# Altium project uPICoid.PrjPCB
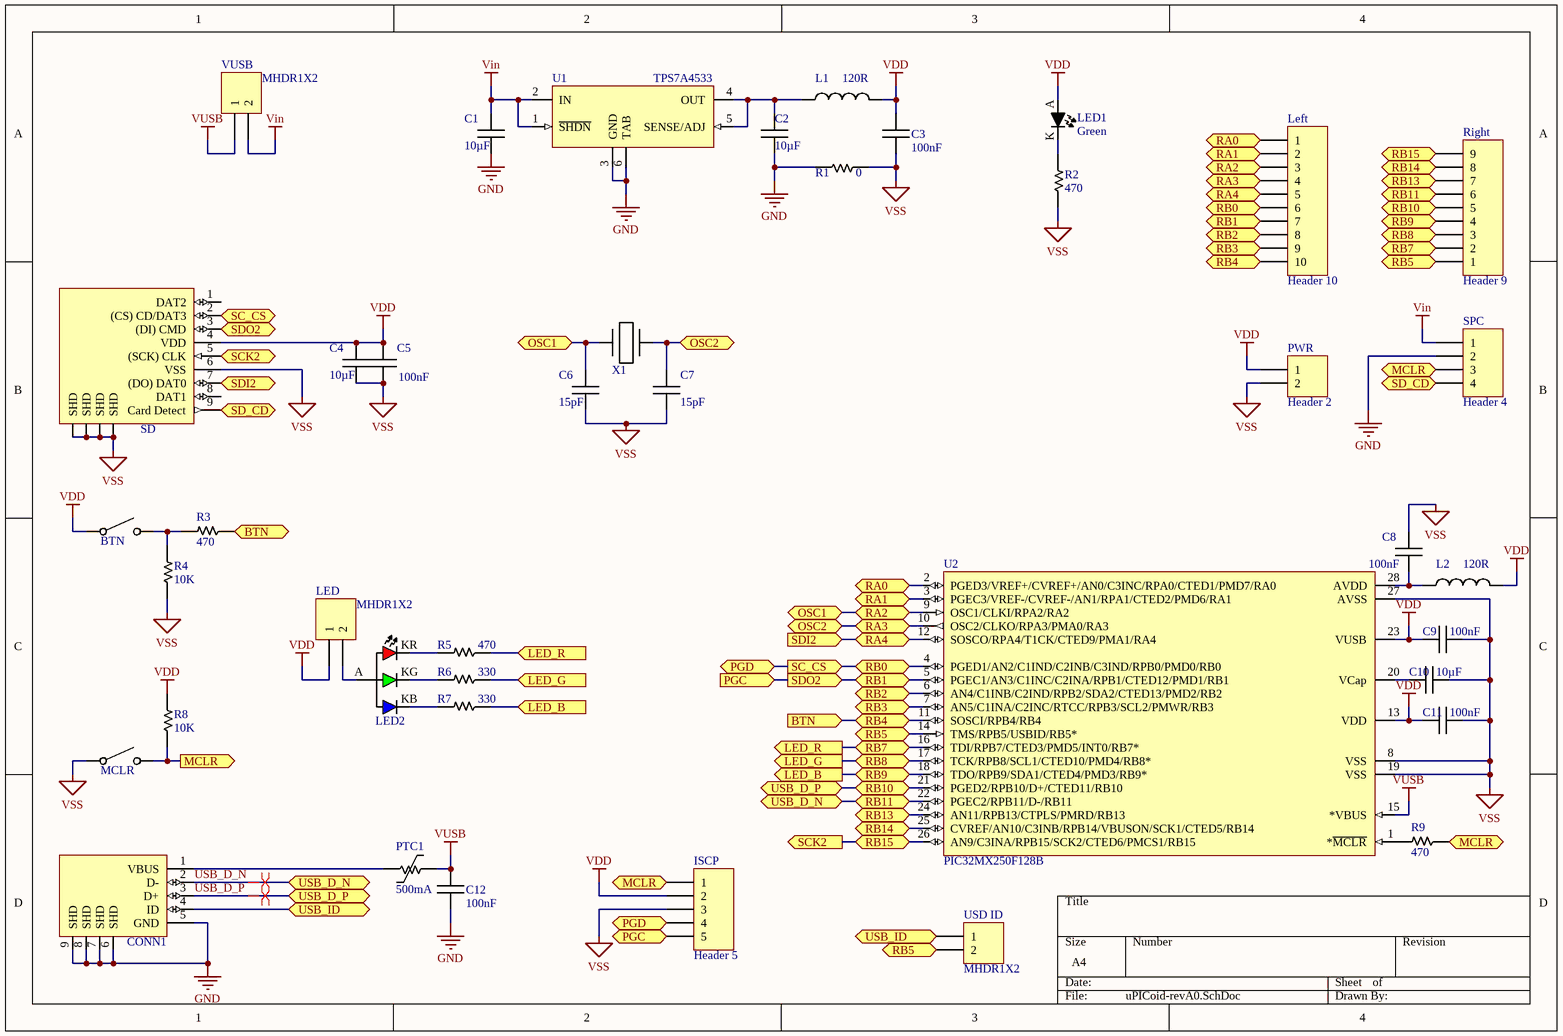
[diagram p0: uPICoid-revA0.SchDoc]
1 sheet, 41 parts. Net scope: flat (ports and power ports of the same name join across sheets).
Board file: uPICoid-revA0.PcbDoc

## Sheet uPICoid-revA0.SchDoc
size A4

### Parts
BTN  Tact Button NO  [TACT SMD 4.5×4.5mm]  (value not drawn)
C1  10µF  [CAPC3225N]
C2  10µF  [CAPC3225N]
C3  100nF  [CAPC1608N]
C4  10µF  [CAPC2012N]
C5  100nF  [CAPC1608N]
C6  15pF  [CAPC1608N]
C7  15pF  [CAPC1608N]
C8  100nF  [CAPC1608N]
C9  100nF  [CAPC1608N]
C10  10µF  [CAPC2012N]
C11  100nF  [CAPC1608N]
C12  100nF  [CAPC1608N]
CONN1  USB-Conn Mini-B SMD  [440478]  (value not drawn)
ISCP  Header 5  [HDR1X5]
L1  120R  [INDC1608N]
L2  120R  [INDC1608N]
LED  MHDR1X2  [MHDR1X2]
LED1  Green  [LED PLCC-2]
LED2  LED RGB common A  [LED 3528m]  (value not drawn)
Left  Header 10  [HDR1X10]
MCLR  Tact Button NO  [TACT SMD 4.5×4.5mm]  (value not drawn)
PTC1  500mA  [RESC3225N]
PWR  Header 2  [HDR1X2]
R1  0  [RESC1608N]
R2  470  [RESC1608N]
R3  470  [RESC1608N]
R4  10K  [RESC1608N]
R5  470  [RESC1608N]
R6  330  [RESC1608N]
R7  330  [RESC1608N]
R8  10K  [RESC1608N]
R9  470  [RESC1608N]
Right  Header 9  [HDR1X9]
SD  microSD Spring-load SMD  [microSD Spring SMD]  (value not drawn)
SPC  Header 4  [HDR1X4]
U1  TPS7A4533  [SOT223-6N]
U2  PIC32MX250F128B  [SSOP28_N]
USD_ID  MHDR1X2  [MHDR1X2]
VUSB  MHDR1X2  [MHDR1X2]
X1  Crystal  [BCY-W2/D3.1]  (value not drawn)

### Ports
BTN (in), BTN (out), LED_B (in), LED_B (out), LED_G (in), LED_G (out), LED_R (in), LED_R (out), MCLR (in), MCLR (out), OSC1 (bidir), OSC2 (bidir), PGC (in), PGC (out), PGD (bidir), RA0 (bidir), RA1 (bidir), RA2 (bidir), RA3 (bidir), RA4 (bidir), RB0 (bidir), RB1 (bidir), RB2 (bidir), RB3 (bidir), RB4 (bidir), RB5 (bidir), RB7 (bidir), RB8 (bidir), RB9 (bidir), RB10 (bidir), RB11 (bidir), RB13 (bidir), RB14 (bidir), RB15 (bidir), SC_CS (in), SC_CS (out), SCK2 (in), SCK2 (out), SD_CD (in), SD_CD (out), SDI2 (in), SDI2 (out), SDO2 (in), SDO2 (out), USB_D_N (bidir), USB_D_P (bidir), USB_ID (bidir)

### Nets
GND: C1.1 C2.1 C12.1 CONN1.5(GND) CONN1.6(SHD) CONN1.7(SHD) CONN1.8(SHD) CONN1.9(SHD) R1.1 SPC.2 U1.3(GND) U1.6(TAB)
VDD: BTN.1 C3.2 C4.2 C5.2 C9.1 C11.1 ISCP.2 L1.2 L2.2 LED.1 LED1.A PWR.1 R8.2 SD.4(VDD) U2.13(VDD) U2.23(VUSB)
Vin: C1.2 SPC.1 U1.1(~{SHDN}) U1.2(IN) VUSB.2
VSS: C3.1 C4.1 C5.1 C6.1 C7.1 C8.2 C9.2 C10.2 C11.2 ISCP.3 MCLR.1 PWR.2 R1.2 R2.1 R4.1 SD.6(VSS) SD.10(SHD) SD.11(SHD) SD.12(SHD) SD.13(SHD) U2.8(VSS) U2.19(VSS) U2.27(AVSS)
VUSB: C12.2 PTC1.2 U2.15(*VBUS) VUSB.1
USB_D_N: CONN1.2(D-) Right.6 U2.22(PGEC2/RPB11/D-/RB11) ; port USB_D_N, port RB11
USB_D_P: CONN1.3(D+) Right.5 U2.21(PGED2/RPB10/D+/CTED11/RB10) ; port USB_D_P, port RB10
NetBTN_2: BTN.2 R3.2 R4.2
NetC2_2: C2.2 L1.1 U1.4(OUT) U1.5(SENSE/ADJ)
NetC6_2: C6.2 Left.3 U2.9(OSC1/CLKI/RPA2/RA2) X1.1 ; port OSC1, port RA2
NetC7_2: C7.2 Left.4 U2.10(OSC2/CLKO/RPA3/PMA0/RA3) X1.2 ; port OSC2, port RA3
NetC8_1: C8.1 L2.1 U2.28(AVDD)
NetC10_1: C10.1 U2.20(VCap)
NetCONN1_1: CONN1.1(VBUS) PTC1.1
NetCONN1_4: CONN1.4(ID) USD_ID.1 ; port USB_ID
NetISCP_1: ISCP.1 MCLR.2 R8.1 R9.1 SPC.3 ; port MCLR
NetISCP_4: ISCP.4 Left.6 SD.2((CS)_CD/DAT3) U2.4(PGED1/AN2/C1IND/C2INB/C3IND/RPB0/PMD0/RB0) ; port SC_CS, port RB0, port PGD
NetISCP_5: ISCP.5 Left.7 SD.3((DI)_CMD) U2.5(PGEC1/AN3/C1INC/C2INA/RPB1/CTED12/PMD1/RB1) ; port SDO2, port RB1, port PGC
NetLED1_K: LED1.K R2.2
NetLED2_KB: LED2.KB R7.2
NetLED2_KG: LED2.KG R6.2
NetLED2_KR: LED2.KR R5.2
NetLED_2: LED.2 LED2.A
NetLeft_1: Left.1 U2.2(PGED3/VREF+/CVREF+/AN0/C3INC/RPA0/CTED1/PMD7/RA0) ; port RA0
NetLeft_2: Left.2 U2.3(PGEC3/VREF-/CVREF-/AN1/RPA1/CTED2/PMD6/RA1) ; port RA1
NetLeft_5: Left.5 SD.7((DO)_DAT0) U2.12(SOSCO/RPA4/T1CK/CTED9/PMA1/RA4) ; port SDI2, port RA4
NetLeft_8: Left.8 U2.6(AN4/C1INB/C2IND/RPB2/SDA2/CTED13/PMD2/RB2) ; port RB2
NetLeft_9: Left.9 U2.7(AN5/C1INA/C2INC/RTCC/RPB3/SCL2/PMWR/RB3) ; port RB3
NetLeft_10: Left.10 R3.1 U2.11(SOSCI/RPB4/RB4) ; port BTN, port RB4
NetR5_1: R5.1 Right.2 U2.16(TDI/RPB7/CTED3/PMD5/INT0/RB7*) ; port LED_R, port RB7
NetR6_1: R6.1 Right.3 U2.17(TCK/RPB8/SCL1/CTED10/PMD4/RB8*) ; port LED_G, port RB8
NetR7_1: R7.1 Right.4 U2.18(TDO/RPB9/SDA1/CTED4/PMD3/RB9*) ; port LED_B, port RB9
NetR9_2: R9.2 U2.1(*~{MCLR})
NetRight_1: Right.1 U2.14(TMS/RPB5/USBID/RB5*) USD_ID.2 ; port RB5
NetRight_7: Right.7 U2.24(AN11/RPB13/CTPLS/PMRD/RB13) ; port RB13
NetRight_8: Right.8 U2.25(CVREF/AN10/C3INB/RPB14/VBUSON/SCK1/CTED5/RB14) ; port RB14
NetRight_9: Right.9 SD.5((SCK)_CLK) U2.26(AN9/C3INA/RPB15/SCK2/CTED6/PMCS1/RB15) ; port SCK2, port RB15
NetSD_9: SD.9(Card_Detect) SPC.4 ; port SD_CD

Not connected (* = marked no-connect by the designer): SD 1(DAT2) 8(DAT1)

### Layout directives
differential pair: USB_D_N, USB_D_P

### Library data of the parts
BTN MCLR = Tact Button NO: pin to pad: 2>4
C1-C12 = Capacitor
  C1 C2 C4 C10: Value: 10µF
  C3 C5 C8 C9 C11 C12: Value: 100nF
  C6 C7: Value: 15pF
ISCP = Header 5: Header, 5-Pin; LatestRevisionDate: 17-Jul-2002; LatestRevisionNote: Re-released for DXP Platform.; Publisher: Altium Limited
L1 L2 = Inductor: Value: 120R
LED USD_ID VUSB = MHDR1X2: Header, 2-Pin; LatestRevisionDate: 17-Jul-2002; LatestRevisionNote: Re-released for DXP Platform.; Publisher: Altium Limited
LED1 = LED: pin to pad: A>2 K>1; Color: Green
LED2 = LED RGB common A: pin to pad: A>2 KB>3 KG>4 KR>1
Left = Header 10: Header, 10-Pin; LatestRevisionDate: 17-Jul-2002; LatestRevisionNote: Re-released for DXP Platform.; Publisher: Altium Limited
PTC1 = PTC: Trip_Current: 500mA
PWR = Header 2: Header, 2-Pin; LatestRevisionDate: 17-Jul-2002; LatestRevisionNote: Re-released for DXP Platform.; Publisher: Altium Limited
R1-R9 = Resistor
  R1: Value: 0
  R2 R3 R5 R9: Value: 470
  R4 R8: Value: 10K
  R6 R7: Value: 330
Right = Header 9: Header, 9-Pin; LatestRevisionDate: 17-Jul-2002; LatestRevisionNote: Re-released for DXP Platform.; Publisher: Altium Limited
SPC = Header 4: Header, 4-Pin; LatestRevisionDate: 17-Jul-2002; LatestRevisionNote: Re-released for DXP Platform.; Publisher: Altium Limited
U1 = TPS7A45xx: VIN: *; VOUT: *
U2 = PIC32MX220FxxxB
X1 = Crystal: Frequency: 16MHz; Precision: 100ppm; Stability: 100ppm